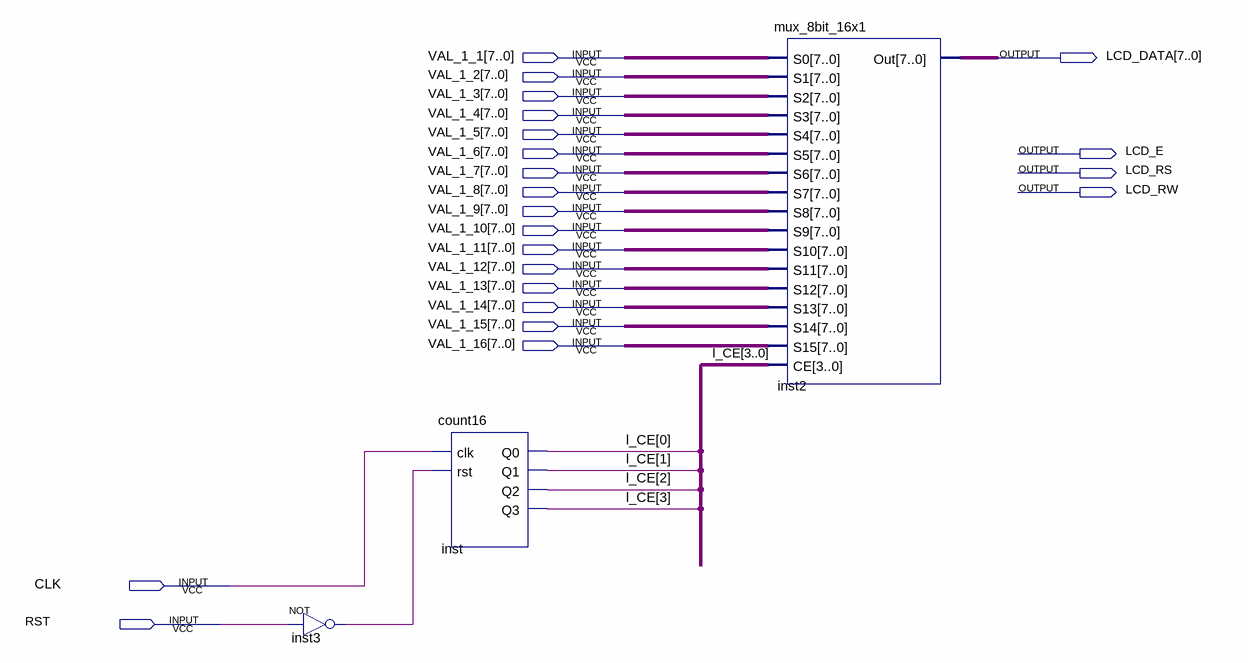
[diagram p0: schematic sheet]
// Quartus schematic tpj.bdf as structural Verilog: 3 symbols, 22 pins
module tpj (
  input  [7:0] VAL_1_1,
  input  [7:0] VAL_1_2,
  input  [7:0] VAL_1_3,
  input  [7:0] VAL_1_4,
  input  [7:0] VAL_1_5,
  input  [7:0] VAL_1_6,
  input  [7:0] VAL_1_7,
  input  [7:0] VAL_1_8,
  input  [7:0] VAL_1_9,
  input  [7:0] VAL_1_10,
  input  [7:0] VAL_1_11,
  input  [7:0] VAL_1_12,
  input  [7:0] VAL_1_13,
  input  [7:0] VAL_1_14,
  input  [7:0] VAL_1_15,
  input  [7:0] VAL_1_16,
  input  CLK,
  input  RST,
  output [7:0] LCD_DATA,
  output LCD_E,
  output LCD_RS,
  output LCD_RW
);

  wire inst3_out;
  wire [3:0] l_CE;

  not inst3 (inst3_out, RST);
  count16 inst (.clk(CLK), .rst(inst3_out), .Q0(l_CE[0]), .Q1(l_CE[1]), .Q2(l_CE[2]), .Q3(l_CE[3]));
  mux_8bit_16x1 inst2 (
    .S0(VAL_1_1), .S1(VAL_1_2), .S2(VAL_1_3), .S3(VAL_1_4), .S4(VAL_1_5), .S5(VAL_1_6), .S6(VAL_1_7),
    .S7(VAL_1_8), .S8(VAL_1_9), .S9(VAL_1_10), .S10(VAL_1_11), .S11(VAL_1_12), .S12(VAL_1_13),
    .S13(VAL_1_14), .S14(VAL_1_15), .S15(VAL_1_16), .CE(l_CE), .Out(LCD_DATA));
endmodule
